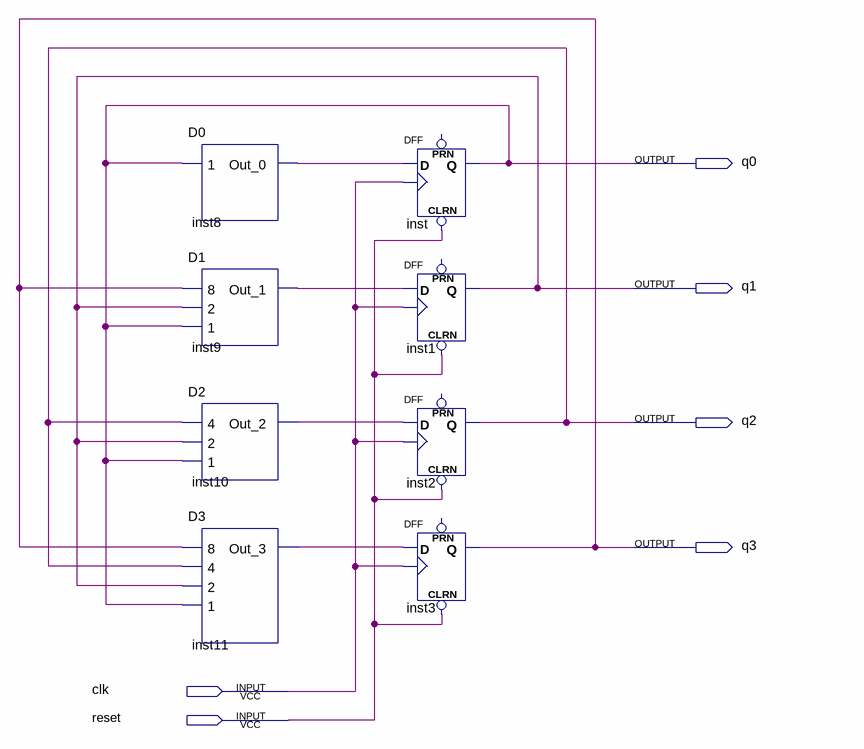
[diagram p0: schematic sheet]
// Quartus schematic BCD_counter.bdf as structural Verilog: 8 symbols, 6 pins
module BCD_counter (
  input  clk,
  input  reset,
  output q0,
  output q1,
  output q2,
  output q3
);

  wire inst8_out_0, inst9_out_1, inst10_out_2, inst11_out_3;

  D0 inst8 (.\1 (q0), .Out_0(inst8_out_0));
  D1 inst9 (.\8 (q3), .\2 (q1), .\1 (q0), .Out_1(inst9_out_1));
  D2 inst10 (.\4 (q2), .\2 (q1), .\1 (q0), .Out_2(inst10_out_2));
  D3 inst11 (.\8 (q3), .\4 (q2), .\2 (q1), .\1 (q0), .Out_3(inst11_out_3));
  DFF inst (.CLRN(reset), .CLK(clk), .D(inst8_out_0), .Q(q0));  // open: PRN
  DFF inst1 (.CLRN(reset), .CLK(clk), .D(inst9_out_1), .Q(q1));  // open: PRN
  DFF inst2 (.CLRN(reset), .CLK(clk), .D(inst10_out_2), .Q(q2));  // open: PRN
  DFF inst3 (.CLRN(reset), .CLK(clk), .D(inst11_out_3), .Q(q3));  // open: PRN
endmodule
